# EAGLE design eNode_Spark (EAGLE 6.4)
REV: V3.3

## Sheet 1 of 4: Power & MCU
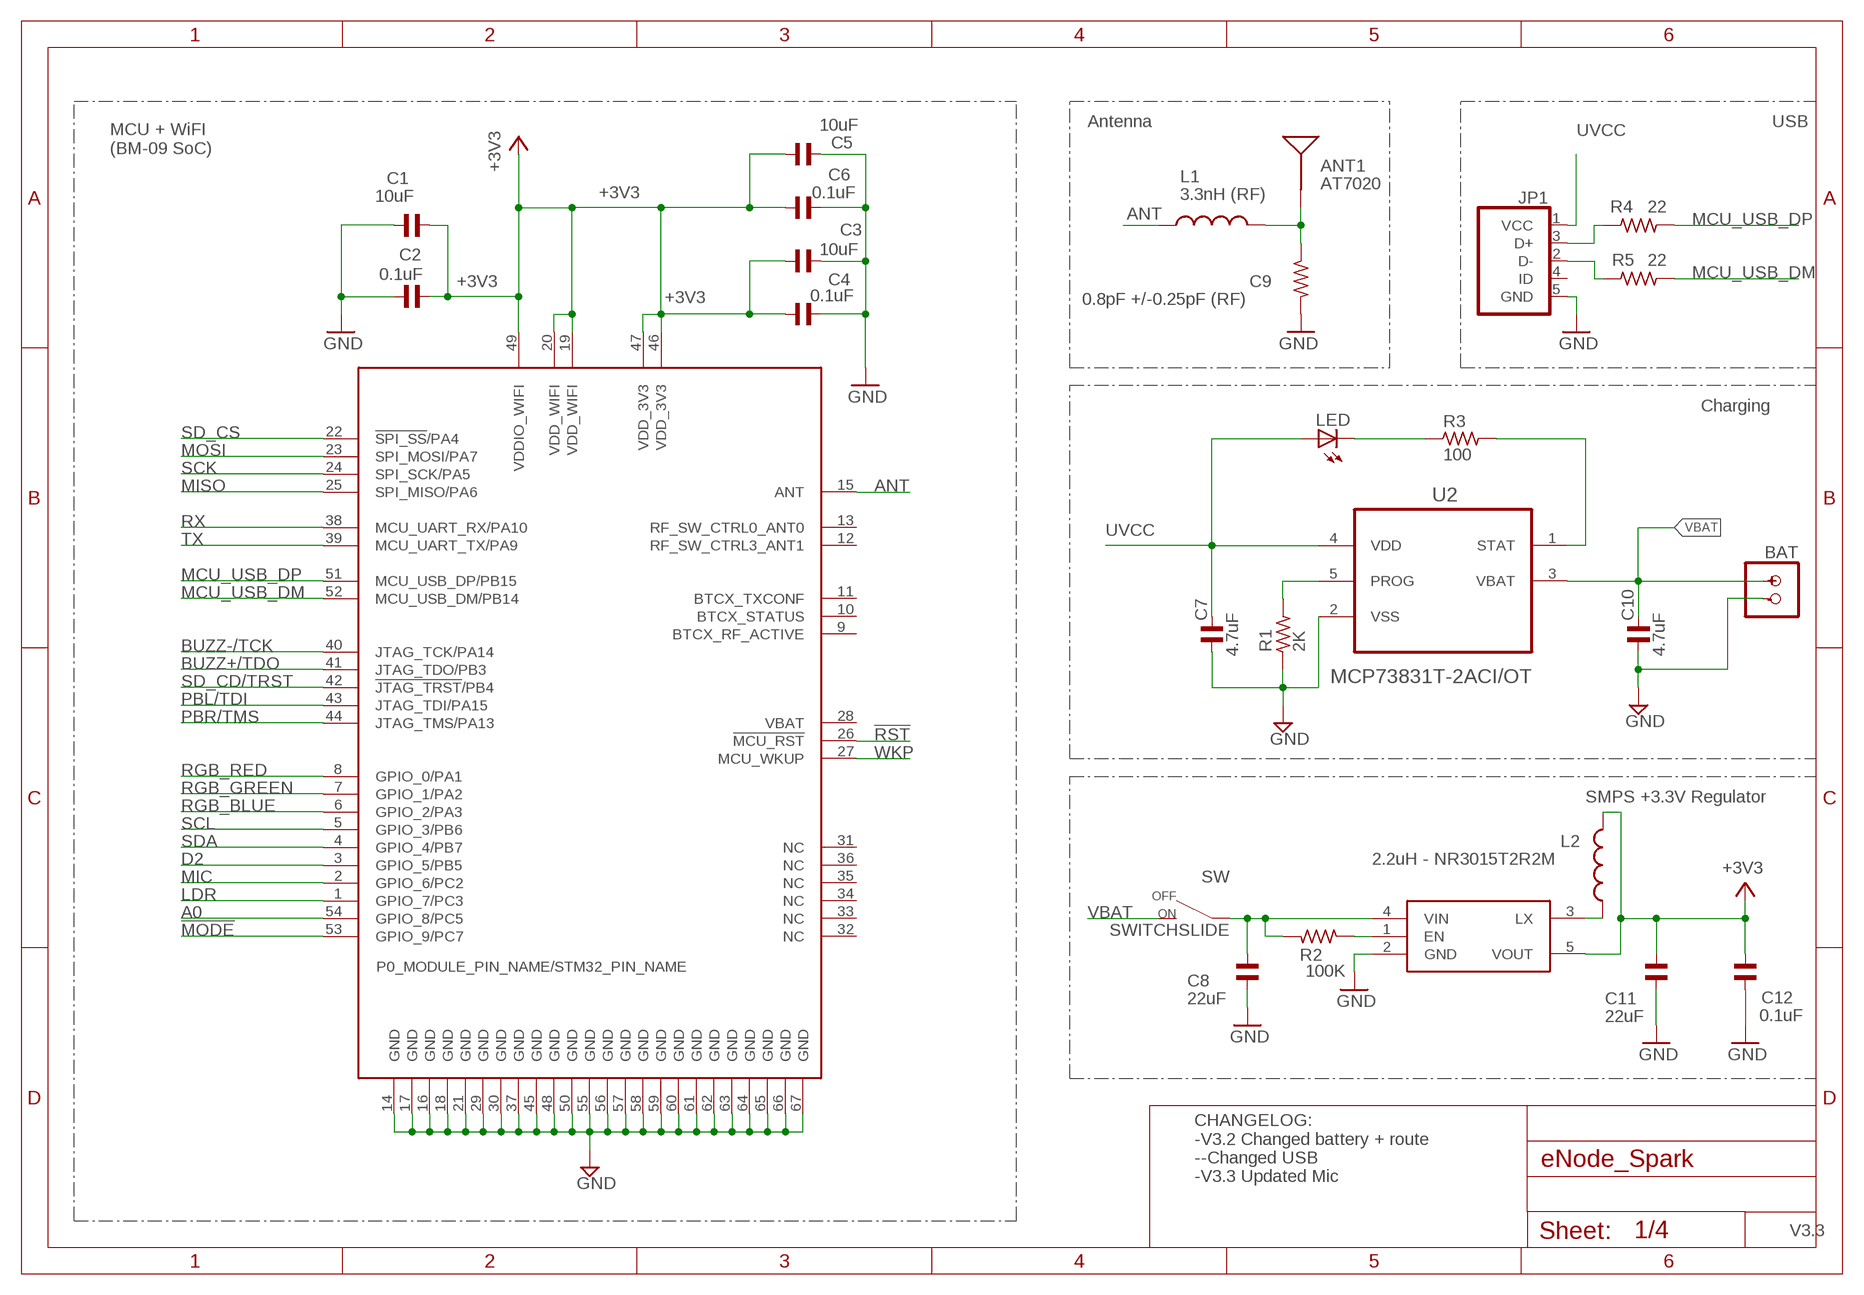
[diagram p0: schematic, sheet 1]

### Parts
ANT1  AT7020  [AT7020]
BAT  BATTERYSMT  [JST-2-SMD]
C1  10uF  C_0402  [C0402]
C2  0.1uF  C_0402  [C0402]
C3  10uF  C_0402  [C0402]
C4  0.1uF  C_0402  [C0402]
C5  10uF  C_0402  [C0402]
C6  0.1uF  C_0402  [C0402]
C7  4.7uF  C_0402  [C0402]
C8  22uF  C_0603  [C0603]
C9  0.8pF +/-0.25pF (RF)  R-US_  [R0402_B]
C10  4.7uF  C_0402  [C0402]
C11  22uF  C_0603  [C0603]
C12  0.1uF  C_0402  [C0402]
JP1  USB-RECEPTABLE  [FCI-10103594-0001LF]
L1  3.3nH (RF)  INDUCTOR  [L0402_B]
L2  2.2uH - NR3015T2R2M  INDUCTORB  [INDUCTOR-NR3015]
LED  LED  [SMARTLED-TTW]
R1  2K  R_0603  [R0603]
R2  100K  R_0402  [R0402]
R3  100  R_0603  [R0603]
R4  22  R_0402  [R0402]
R5  22  R_0402  [R0402]
SW  SWITCHSLIDE  [CHANGE_OVER_SLIDE]
U1  WM-N-BM-09  [WM-N-BM-09]
U2  MCP73831T-2ACI/OT  [SOT95P280X145-5N]
U3  R8008-33  [SOT23-5]

### Nets
!MODE: U1.53(GPIO_9/PC7) ; also sheet 3
!RST: U1.26(!MCU_RST) ; also sheet 3
+3V3: C1.2 C2.2 C3.1 C4.2 C5.1 C6.2 C11.1 C12.1 L2.2 U1.19(VDD_WIFI) U1.20(VDD_WIFI) U1.46(VDD_3V3) U1.47(VDD_3V3) U1.49(VDDIO_WIFI) U3.5(VOUT) ; also sheet 2,3,4
A0: U1.54(GPIO_8/PC5)
ANT [RF]: L1.1 U1.15(ANT)
BUZZ+/TDO: U1.41(JTAG_TDO/PB3) ; also sheet 3
BUZZ-/TCK: U1.40(JTAG_TCK/PA14) ; also sheet 3
D2: U1.3(GPIO_5/PB5) ; also sheet 4
ENABLE [vcc]: R2.1 U3.1(EN)
GND: BAT.- C1.1 C2.1 C3.2 C4.1 C5.2 C6.1 C7.1 C8.2 C9.2 C10.1 C11.2 C12.2 JP1.5(GND) R1.1 U1.14(GND) U1.16(GND) U1.17(GND) U1.18(GND) U1.21(GND) U1.29(GND) U1.30(GND) U1.37(GND) U1.45(GND) U1.48(GND) U1.50(GND) U1.55(GND) U1.56(GND) U1.57(GND) U1.58(GND) U1.59(GND) U1.60(GND) U1.61(GND) U1.62(GND) U1.63(GND) U1.64(GND) U1.65(GND) U1.66(GND) U1.67(GND) U2.2(VSS) U3.2(GND) ; also sheet 2,3,4
LDR: U1.1(GPIO_7/PC3) ; also sheet 3
MCU_USB_DM: R5.1 U1.52(MCU_USB_DM/PB14)
MCU_USB_DP: R4.1 U1.51(MCU_USB_DP/PB15)
MIC: U1.2(GPIO_6/PC2) ; also sheet 3
MISO: U1.25(SPI_MISO/PA6) ; also sheet 3,4
MOSI: U1.23(SPI_MOSI/PA7) ; also sheet 3,4
N$1 [RF]: ANT1.1(SIGNAL) C9.1 L1.2
N$2: C8.1 R2.2 SW.1 U3.4(VIN)
N$3: L2.1 U3.3(LX)
N$4: R1.2 U2.5(PROG)
N$5: LED.C@1(C) R3.1
N$6: R3.2 U2.1(STAT)
N$17: JP1.2(D-) R5.2
N$18: JP1.3(D+) R4.2
PBL/TDI: U1.43(JTAG_TDI/PA15) ; also sheet 3
PBR/TMS: U1.44(JTAG_TMS/PA13) ; also sheet 3
RGB_BLUE [vcc]: U1.6(GPIO_2/PA3) ; also sheet 3
RGB_GREEN: U1.7(GPIO_1/PA2) ; also sheet 3
RGB_RED: U1.8(GPIO_0/PA1) ; also sheet 3
RX: U1.38(MCU_UART_RX/PA10) ; also sheet 3
SCK: U1.24(SPI_SCK/PA5) ; also sheet 3,4
SCL: U1.5(GPIO_3/PB6) ; also sheet 2,4
SD_CD/TRST: U1.42(!JTAG_TRST!/PB4) ; also sheet 3
SD_CS: U1.22(!SPI_SS!/PA4) ; also sheet 3,4
SDA: U1.4(GPIO_4/PB7) ; also sheet 2,4
TX: U1.39(MCU_UART_TX/PA9) ; also sheet 3
UVCC: C7.2 JP1.1(VCC) LED.A@1(A) U2.4(VDD)
VBAT: BAT.+ C10.2 SW.2 U2.3(VBAT)
WKP: U1.27(MCU_WKUP) ; also sheet 2,4
Unconnected: JP1.4(ID) U1.9(BTCX_RF_ACTIVE) U1.10(BTCX_STATUS) U1.11(BTCX_TXCONF) U1.12(RF_SW_CTRL3_ANT1) U1.13(RF_SW_CTRL0_ANT0) U1.28(VBAT) U1.31(NC) U1.32(NC) U1.33(NC) U1.34(NC) U1.35(NC) U1.36(NC)

### Notes on the sheet
- Antenna | USB
- MCU + WiFI
  (BM-09 SoC)
- Charging
- SMPS +3.3V Regulator
- CHANGELOG:
  -V3.2 Changed battery + route
  --Changed USB
  -V3.3 Updated Mic

## Sheet 2 of 4: I2C
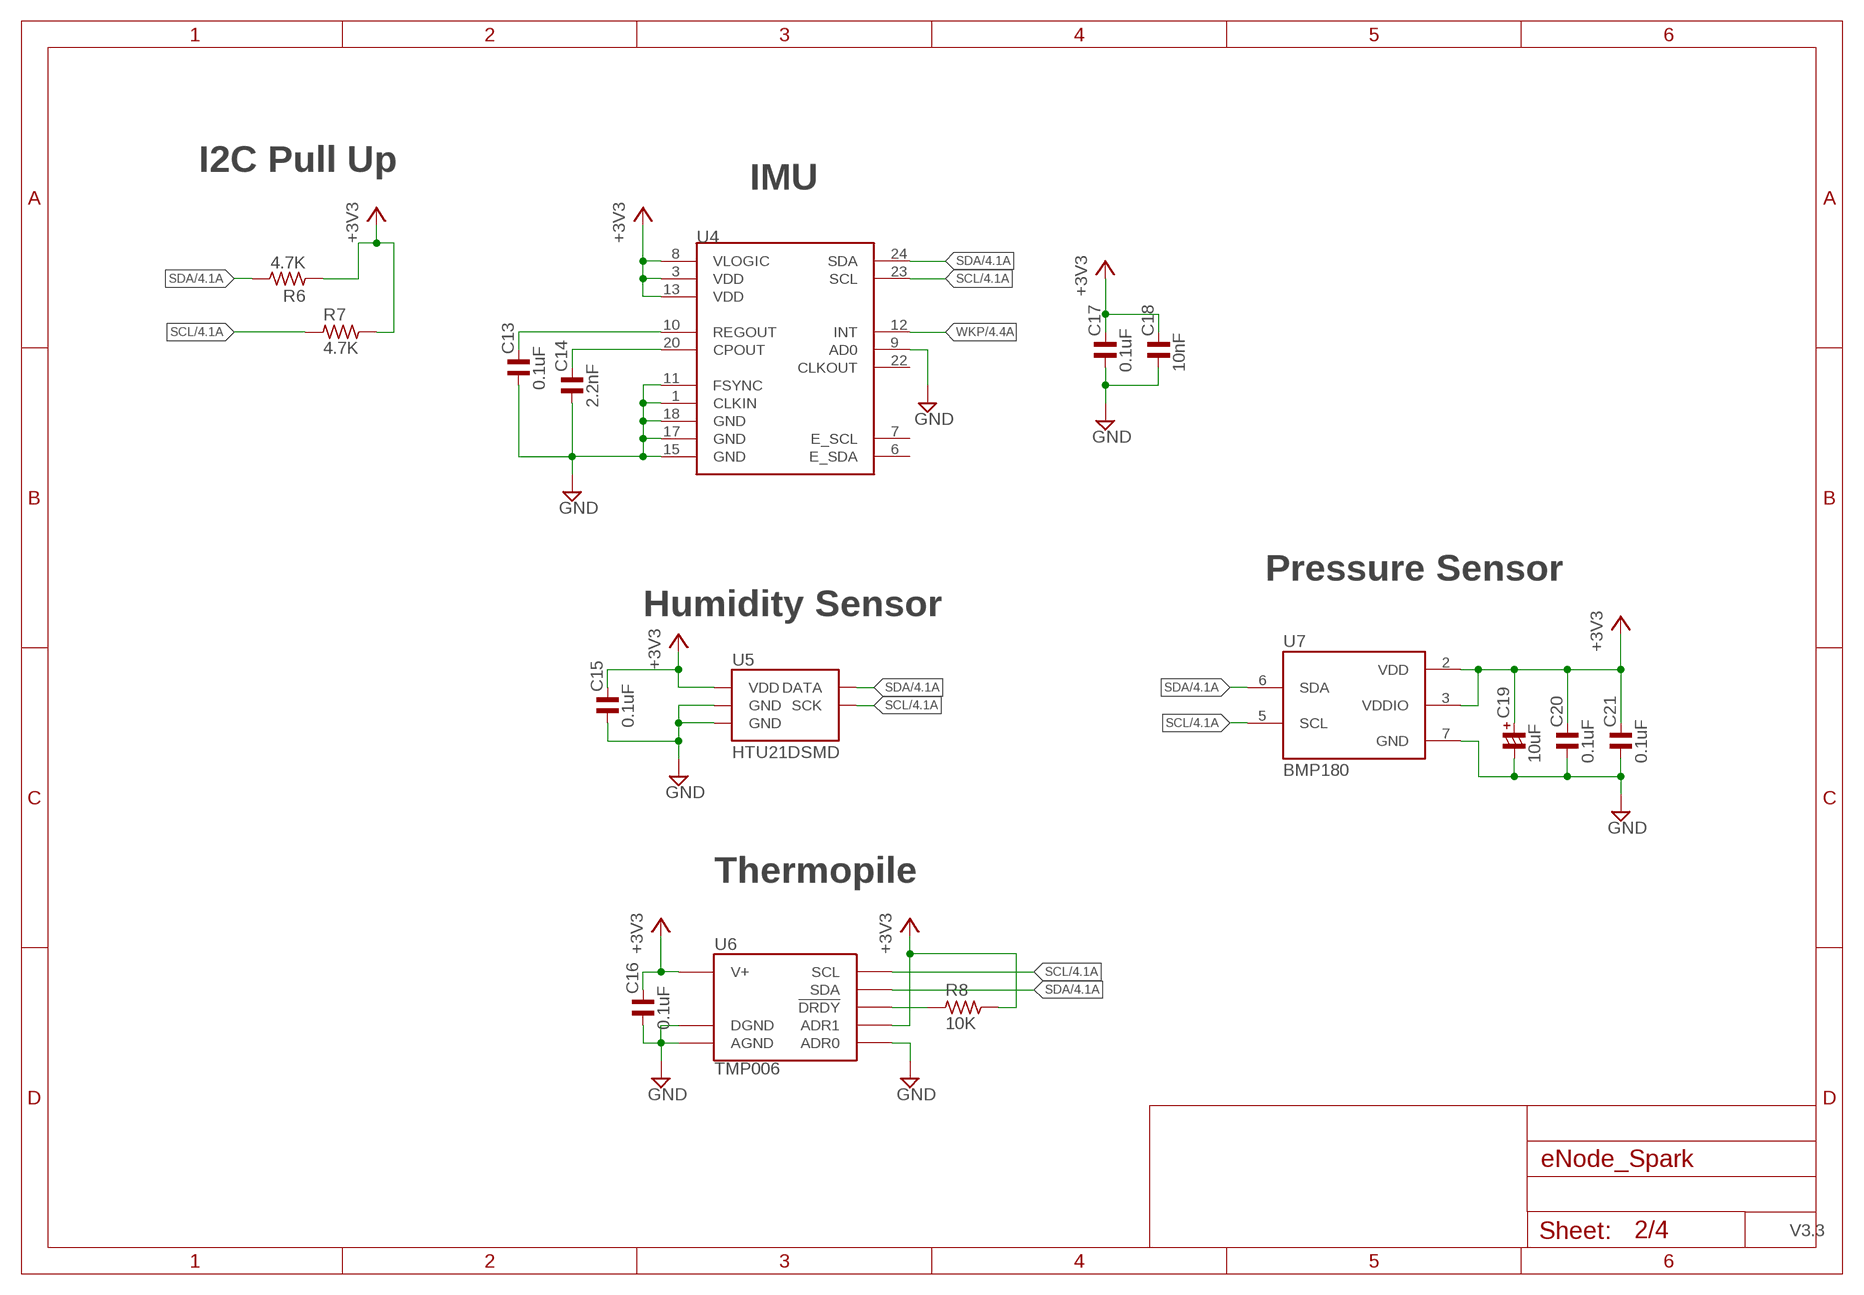
[diagram p1: schematic, sheet 2]

### Parts
C13  0.1uF  C_0402  [C0402]
C14  2.2nF  C_0402  [C0402]
C15  0.1uF  C_0402  [C0402]
C16  0.1uF  C_0402  [C0402]
C17  0.1uF  C_0402  [C0402]
C18  10nF  C_0402  [C0402]
C19  10uF  CP_1206/T  [C1206/T]
C20  0.1uF  C_0402  [C0402]
C21  0.1uF  C_0402  [C0402]
R6  4.7K  R_0402  [R0402]
R7  4.7K  R_0402  [R0402]
R8  10K  R_0603  [R0603]
U4  MPU-9150QFN-24-NP  [QFN-24-NP]
U5  HTU21DSMD  [HTU21D]
U6  TMP006  [BGA8DS]
U7  BMP180  [BMP180]

### Nets
+3V3: C15.2 C16.2 C17.2 C18.2 C19.+ C20.2 C21.2 R6.1 R7.2 R8.2 U4.3(VDD) U4.8(VLOGIC) U4.13(VDD) U5.VDD U6.A3(V+) U6.B1(ADR1) U7.2(VDD) U7.3(VDDIO) ; also sheet 1,3,4
GND: C13.1 C14.1 C15.1 C16.1 C17.1 C18.1 C19.- C20.1 C21.1 U4.1(CLKIN) U4.9(AD0) U4.11(FSYNC) U4.15(GND) U4.17(GND) U4.18(GND) U5.7(GND) U5.GND U6.A1(DGND) U6.A2(AGND) U6.C1(ADR0) U7.7(GND) ; also sheet 1,3,4
N$12: C14.2 U4.20(CPOUT)
N$13: R8.1 U6.C2(!DRDY)
N$14: C13.2 U4.10(REGOUT)
SCL: R7.1 U4.23(SCL) U5.SCK U6.B3(SCL) U7.5(SCL) ; also sheet 1,4
SDA: R6.2 U4.24(SDA) U5.DATA U6.C3(SDA) U7.6(SDA) ; also sheet 1,4
WKP: U4.12(INT) ; also sheet 1,4
Unconnected: U4.6(E_SDA) U4.7(E_SCL) U4.22(CLKOUT)

### Notes on the sheet
- I2C Pull Up
- IMU
- Pressure Sensor
- Humidity Sensor
- Thermopile

## Sheet 3 of 4: Other IO
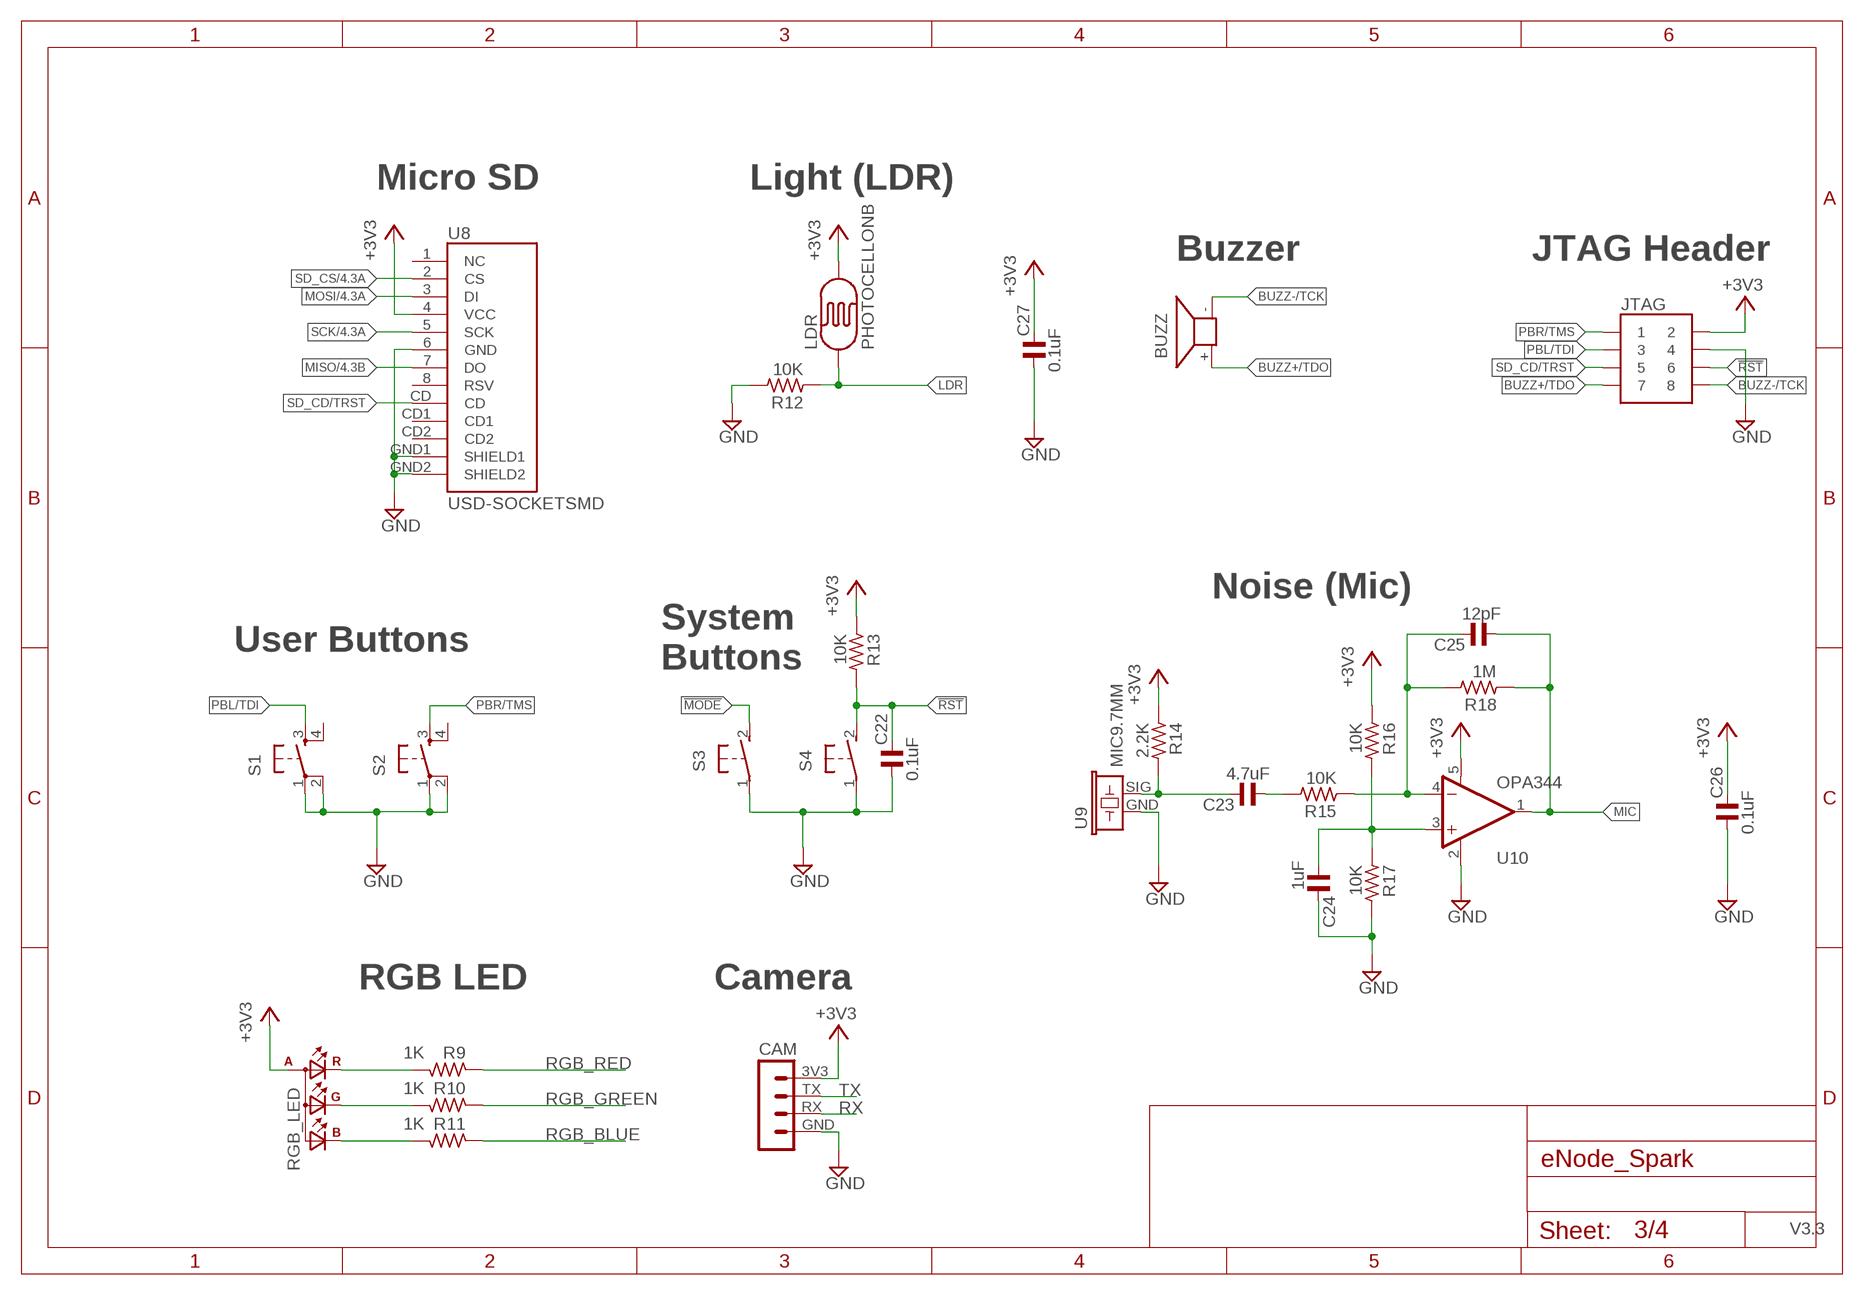
[diagram p2: schematic, sheet 3]

### Parts
BUZZ  BUZZER  [OFFBOARD_NOSIGN]
C22  0.1uF  C_0402  [C0402]
C23  4.7uF  C_0402  [C0402]
C24  1uF  C_0402  [C0402]
C25  12pF  C_0402  [C0402]
C26  0.1uF  C_0402  [C0402]
C27  0.1uF  C_0402  [C0402]
CAM  MA04-1  [MA04-1]
JTAG  JTAG_CONNECTOR  [JTAG_DIP]
LDR  PHOTOCELLONB  [ON_BOARD]
R9  1K  R_0402  [R0402]
R10  1K  R_0402  [R0402]
R11  1K  R_0402  [R0402]
R12  10K  R_0603  [R0603]
R13  10K  R_0402  [R0402]
R14  2.2K  R_0402  [R0402]
R15  10K  R_0402  [R0402]
R16  10K  R_0402  [R0402]
R17  10K  R_0402  [R0402]
R18  1M  R_0402  [R0402]
RGB_LED  TOPLED-3PLCC  [P-LCC-4-3]
S1  TAC_SWITCH_4SMD  [TACTILE_SWITCH_SMD_LARGE_4]
S2  TAC_SWITCH_4SMD  [TACTILE_SWITCH_SMD_LARGE_4]
S3  MODE  TAC_SWITCH_2MULTICOMP  [DTSM-3]
S4  RESET  TAC_SWITCH_2MULTICOMP  [DTSM-3]
U8  USD-SOCKETSMD  [MICRO-SD-SOCKET-PP]
U9  MIC9.7MM  [MIC-9.7MM]
U10  OPA344  [SOT23-5]

### Nets
!MODE: S3.2 ; also sheet 1
!RST: C22.2 JTAG.6 R13.2 S4.2 ; also sheet 1
+3V3: C26.2 C27.2 CAM.3V3 JTAG.2 LDR.2 R13.1 R14.1 R16.1 RGB_LED.A(A2) U8.4(VCC) U10.5(V+) ; also sheet 1,2,4
BUZZ+/TDO: BUZZ.+ JTAG.7 ; also sheet 1
BUZZ-/TCK: BUZZ.- JTAG.8 ; also sheet 1
GND: C22.1 C24.2 C26.1 C27.1 CAM.GND JTAG.4 R12.2 R17.2 S1.1 S1.2 S2.1 S2.2 S3.1 S4.1 U8.6(GND) U8.GND1(SHIELD1) U8.GND2(SHIELD2) U9.GND U10.2(V-) ; also sheet 1,2,4
LDR: LDR.1 R12.1 ; also sheet 1
MIC: C25.1 R18.1 U10.1(OUT) ; also sheet 1
MISO: U8.7(DO) ; also sheet 1,4
MOSI: U8.3(DI) ; also sheet 1,4
N$7: C23.1 R15.2
N$8: C25.2 R15.1 R18.2 U10.4(-IN)
N$9: C24.1 R16.2 R17.1 U10.3(+IN)
N$10: C23.2 R14.2 U9.SIG
N$27: R10.1 RGB_LED.G(CGREEN)
N$29: R11.1 RGB_LED.B(CBLUE)
N$54: R9.1 RGB_LED.R(CRED)
PBL/TDI: JTAG.3 S1.3 ; also sheet 1
PBR/TMS: JTAG.1 S2.3 ; also sheet 1
RGB_BLUE [vcc]: R11.2 ; also sheet 1
RGB_GREEN: R10.2 ; also sheet 1
RGB_RED: R9.2 ; also sheet 1
RX: CAM.RX ; also sheet 1
SCK: U8.5(SCK) ; also sheet 1,4
SD_CD/TRST: JTAG.5 U8.CD ; also sheet 1
SD_CS: U8.2(CS) ; also sheet 1,4
TX: CAM.TX ; also sheet 1
Unconnected: S1.4 S2.4 U8.1(NC) U8.8(RSV) U8.CD1 U8.CD2

### Notes on the sheet
- Micro SD | Light (LDR)
- Buzzer | JTAG Header
- Noise (Mic)
- User Buttons
- System
  Buttons
- RGB LED | Camera

## Sheet 4 of 4: V3.4
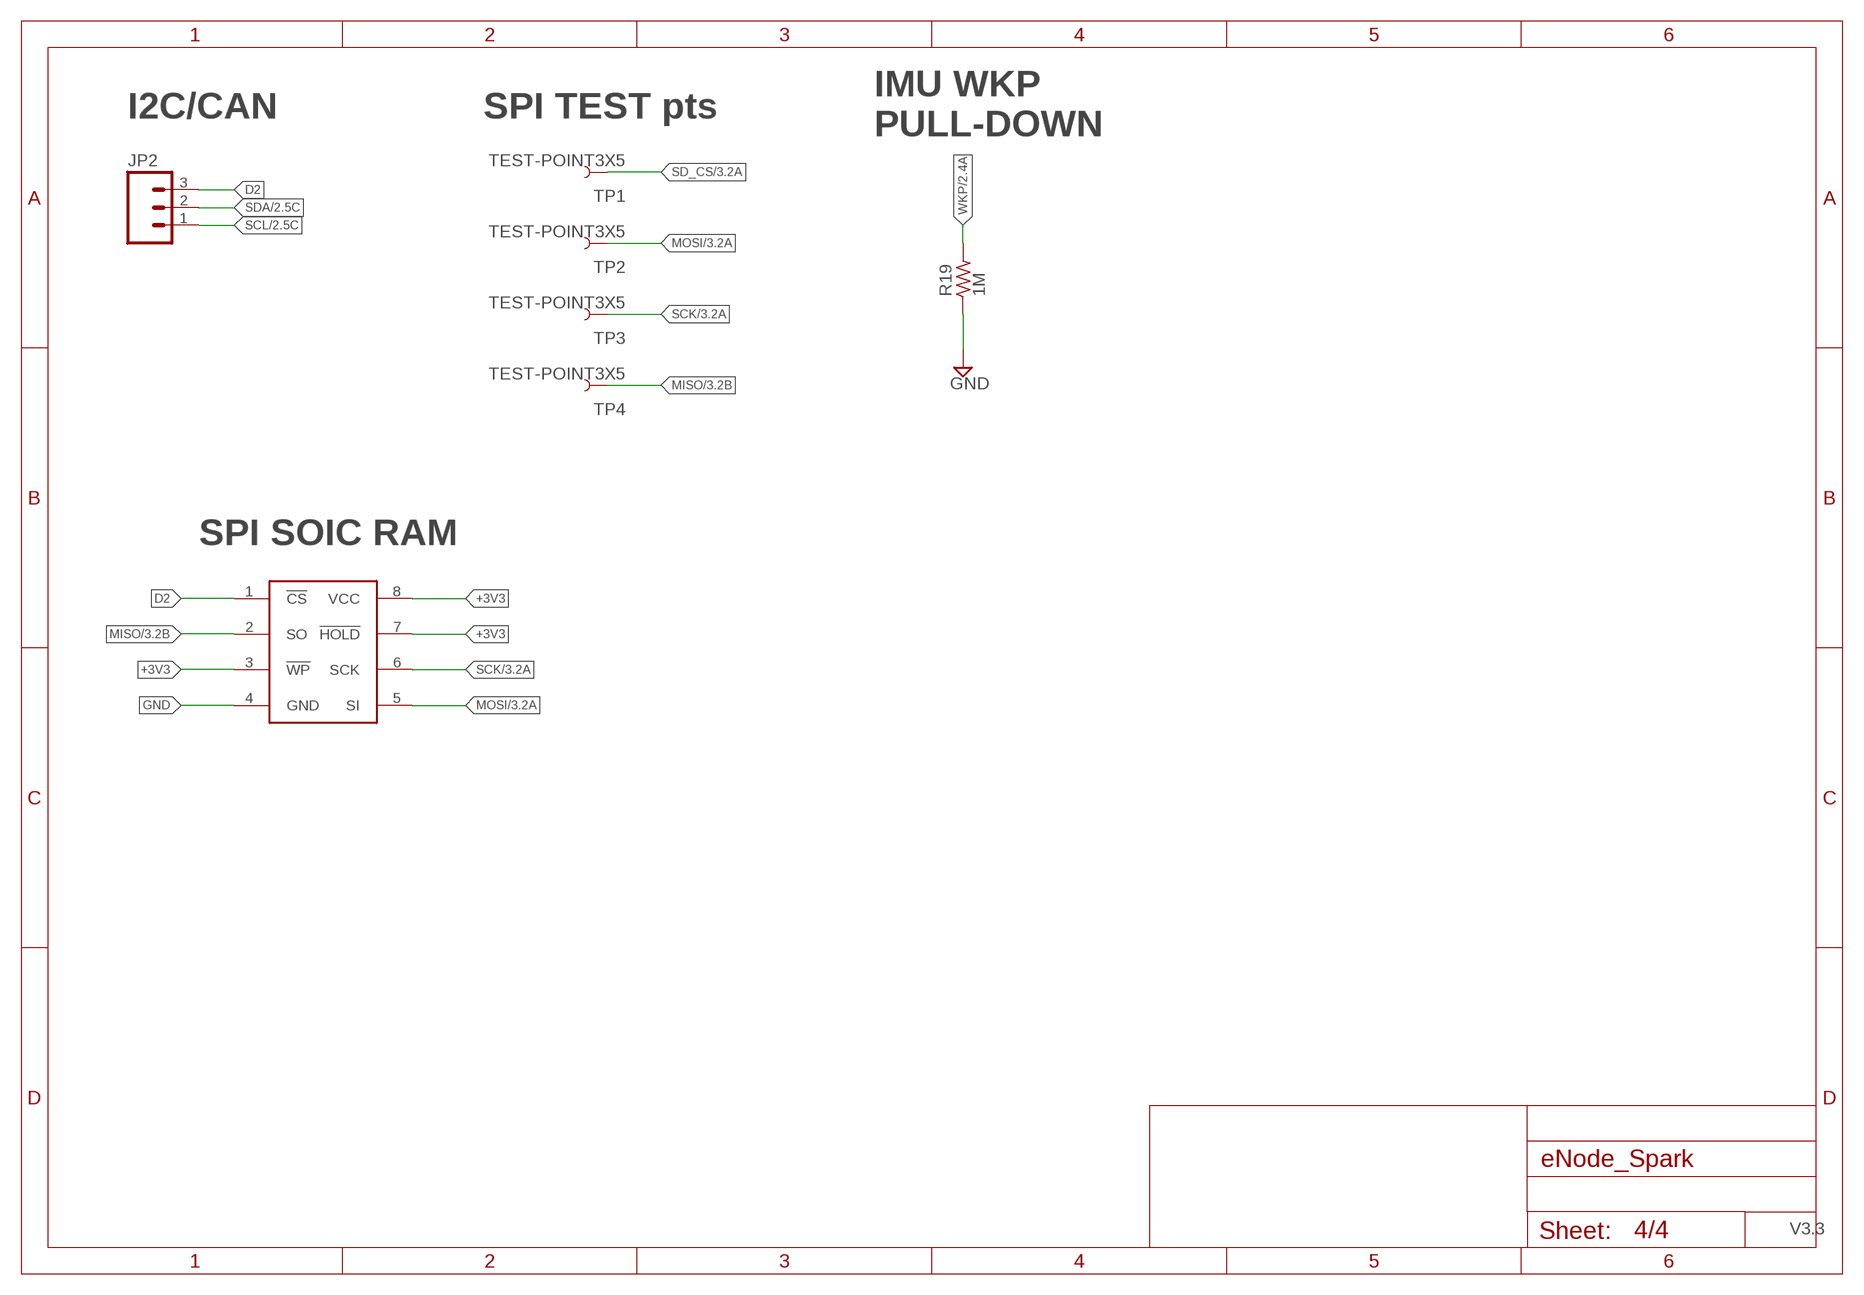
[diagram p3: schematic, sheet 4]

### Parts
JP2  M03PTH  [1X03]
R19  1M  R_0402  [R0402]
TP1  TEST-POINT3X5  [PAD.03X.05]
TP2  TEST-POINT3X5  [PAD.03X.05]
TP3  TEST-POINT3X5  [PAD.03X.05]
TP4  TEST-POINT3X5  [PAD.03X.05]
U11  FRAM  [SO08]

### Nets
+3V3: U11.3(!WP) U11.7(!HOLD) U11.8(VCC) ; also sheet 1,2,3
D2: JP2.3 U11.1(!CS) ; also sheet 1
GND: R19.1 U11.4(GND) ; also sheet 1,2,3
MISO: TP4.P$1 U11.2(SO) ; also sheet 1,3
MOSI: TP2.P$1 U11.5(SI) ; also sheet 1,3
SCK: TP3.P$1 U11.6(SCK) ; also sheet 1,3
SCL: JP2.1 ; also sheet 1,2
SD_CS: TP1.P$1 ; also sheet 1,3
SDA: JP2.2 ; also sheet 1,2
WKP: R19.2 ; also sheet 1,2

### Notes on the sheet
- I2C/CAN | SPI TEST pts
- IMU WKP 
  PULL-DOWN
- SPI SOIC RAM

## Library data of the parts
ANT1 = Spark:AT7020
BAT = Battery:BATTERY: PIN HEADER
BUZZ = Buzzer:BUZZER: Buzzer
C1-C8 C10-C18 C20-C27 = rc-master-smd:C_: NON-POLARIZED CAP
C9 = Spark:R-US_: 0402 Resistor
C19 = rc-master-smd:CP_: POLARIZED CAP
CAM = Camera Header:MA04-1: PIN HEADER; OC_FARNELL: unknown; OC_NEWARK: unknown
JP1 = Micro USB:USB-RECEPTABLE: USB Receptable
JP2 = SparkFun-Connectors:M03: Header 3 Standard 3-pin 0.1" header. Use with straight break away headers (SKU : PRT-00116), right angle break away headers (PRT-00553), swiss pins (PRT-00743), machine pins (PRT-00117), and female headers (PRT-00115). Molex polarized connector foot print use with SKU : PRT-08232 with associated crimp pins and housings.
JTAG = JTAG Connector:JTAG_CONNECTOR
L1 L2 = Spark:INDUCTOR
LDR = LDR:PHOTOCELL: Photo Resitor
LED = LED:LED: LED OSRAM: - CHIPLED LG R971, LG N971, LY N971, LG Q971, LY Q971, LO R971, LY R971 LH N974, LH R974 LS Q976, LO Q976, LY Q976 LO Q996 - Hyper CHIPLED LW Q18S LB Q993, LB Q99A, LB R99A - SideLED LS A670, LO A670, LY A670, LG A670, LP A670 LB A673, LV A673, LT A673, LW A673 LH A674 LY A675 LS A676, LA A676, LO A676, LY A676, LW A676 LS A679, LY A679, LG A679 - Hyper Micro SIDELED® LS Y876, LA Y876, LO Y876, LY Y876 LT Y87S - SmartLED LW L88C, LW L88S LB L89C, LB L89S, LG L890 LS L89K, LO L89K, LY L89K LS L896, LA L896, LO L896, LY L896 - TOPLED LS T670, LO T670, LY T670, LG T670, LP T670 LSG T670, LSP T670, LSY T670, LOP T670, LYG T670 LG T671, LOG T671, LSG T671 LB T673, LV T673, LT T673, LW T673 LH T674 LS T676, LA T676, LO T676, LY T676, LB T676, LH T676, LSB T676, LW T676 LB T67C, LV T67C, LT T67C, LS T67K, LO T67K, LY T67K, LW E67C LS E67B, LA E67B, LO E67B, LY E67B, LB E67C, LV E67C, LT E67C LW T67C LS T679, LY T679, LG T679 LS T770, LO T770, LY T770, LG T770, LP T770 LB T773, LV T773, LT T773, LW T773 LH T774 LS E675, LA E675, LY E675, LS T675 LS T776, LA T776, LO T776, LY T776, LB T776 LHGB T686 LT T68C, LB T68C - Hyper Mini TOPLED® LB M676 - Mini TOPLED Santana® LG M470 LS M47K, LO M47K, LY M47K Source: http://www.osram.convergy.de LUXEON: - LUMILED® LXK2-PW12-R00, LXK2-PW12-S00, LXK2-PW14-U00, LXK2-PW14-V00 LXK2-PM12-R00, LXK2-PM12-S00, LXK2-PM14-U00 LXK2-PE12-Q00, LXK2-PE12-R00, LXK2-PE12-S00, LXK2-PE14-T00, LXK2-PE14-U00 LXK2-PB12-K00, LXK2-PB12-L00, LXK2-PB12-M00, LXK2-PB14-N00, LXK2-PB14-P00, LXK2-PB14-Q00 LXK2-PR12-L00, LXK2-PR12-M00, LXK2-PR14-Q00, LXK2-PR14-R00 LXK2-PD12-Q00, LXK2-PD12-R00, LXK2-PD12-S00 LXK2-PH12-R00, LXK2-PH12-S00 LXK2-PL12-P00, LXK2-PL12-Q00, LXK2-PL12-R00 Source: www.luxeon.com KINGBRIGHT: KA-3528ASYC Source: www.kingbright.com
R1-R19 = rc-master-smd:R_: RESISTOR
RGB_LED = SMD RGB LED:TOPLED-3: Cree P/N: CLV1L-FKB-CHMMQEHBB7673673
S1 S2 = TACT BUTTON:TAC_SWITCH_4
S3 S4 = TACT BUTTON:TAC_SWITCH_2
SW = Switch:SWITCH
TP1-TP4 = SparkFun-Passives:TEST-POINT: Bare copper test points for troubleshooting or ICT
U1 = Spark:WM-N-BM-09
U2 = MCP73831T (LiPo Charger):MCP73831T-2ACI/OT: Charge Management Controller; MPN: MCP73831T-2ACI/OT; OC_FARNELL: 1332158; OC_NEWARK: 56K7045; PACKAGE: SOT-5; SUPPLIER: Microchip
U3 = Spark:R8008-33
U4 = MPU-9150:MPU-9150: 9DOF (3mag, 3accel, 3rotat). I2C interface.
U5 = HTU21D:HTU21D
U6 = TMP006:TMP006
U7 = BMP180:BMP180: BOSCH BMP180 DIGITAL BAROMETRIC PRESSURE SENSOR Web page: http://www.bosch-sensortec.com/en/homepage/products_3/environmental_sensors_1/bmp180_1/bmp180 Datasheet: http://ae-bst.resource.bosch.com/media/products/dokumente/bmp180/BST-BMP180-DS000-09.pdf The BMP180 is the function compatible successor of the BMP085, a new generation of high precision digital pressure sensors for consumer applications. The ultra-low power, low voltage electronics of the BMP180 is optimized for use in mobile phones, PDAs, GPS navigation devices and outdoor equipment. With a low altitude noise of merely 0.25m at fast conversion time, the BMP180 offers superior performance. The I2C interface allows for easy system integration with a microcontroller. The BMP180 is based on piezo-resistive technology for EMC robustness, high accuracy and linearity as well as long term stability. Key features: - Temperature measurement included - I2C interface - Fully calibrated - Pb-free, halogen-free and RoHS compliant, - MSL 1 Basic specs: Pressure range: 300 to 1100hPa (+9000m to -500m relating to sea level) Supply voltage: 1.8 to 3.6V (VDD), 1.62V to 3.6V (VDDIO) Package: LGA package with metal lid Small footprint: 3.6mm x 3.8mm Super-flat: 0.93mm height Low power: 5µA at 1 sample / sec. in standard mode Low noise: 0.06hPa (0.5m) in ultra low power mode, 0.02hPa (0.17m) advanced resolution mode Typical applications: - Enhancement of GPS navigation (dead-reckoning, slope detection, etc.) - In- and out-door navigation - Leisure and sports - Weather forecast - Vertical velocity indication (rise/sink speed)
U8 = MicroSD:USD-SOCKET: microSD Socket Push-push type uSD socket. Schematic element and footprint production proven. Spark Fun Electronics SKU : PRT-00127. tDoc lines correctly indicate media card edge positions when inserting (unlocked, locked, depressed).; ORDERCODE: 2143377; SUPPLIER: ELEMENT14
U9 = MIC:MIC: Microphone Omni-directional electret microphone. 9.7mm standard diameter.
U10 = OPA344:OPA344
U11 = kennethlimcp:FRAM: 8-SOIC FRAM

## Net classes
2 RF: width 0.33 mm, clearance 0.178 mm

## Board
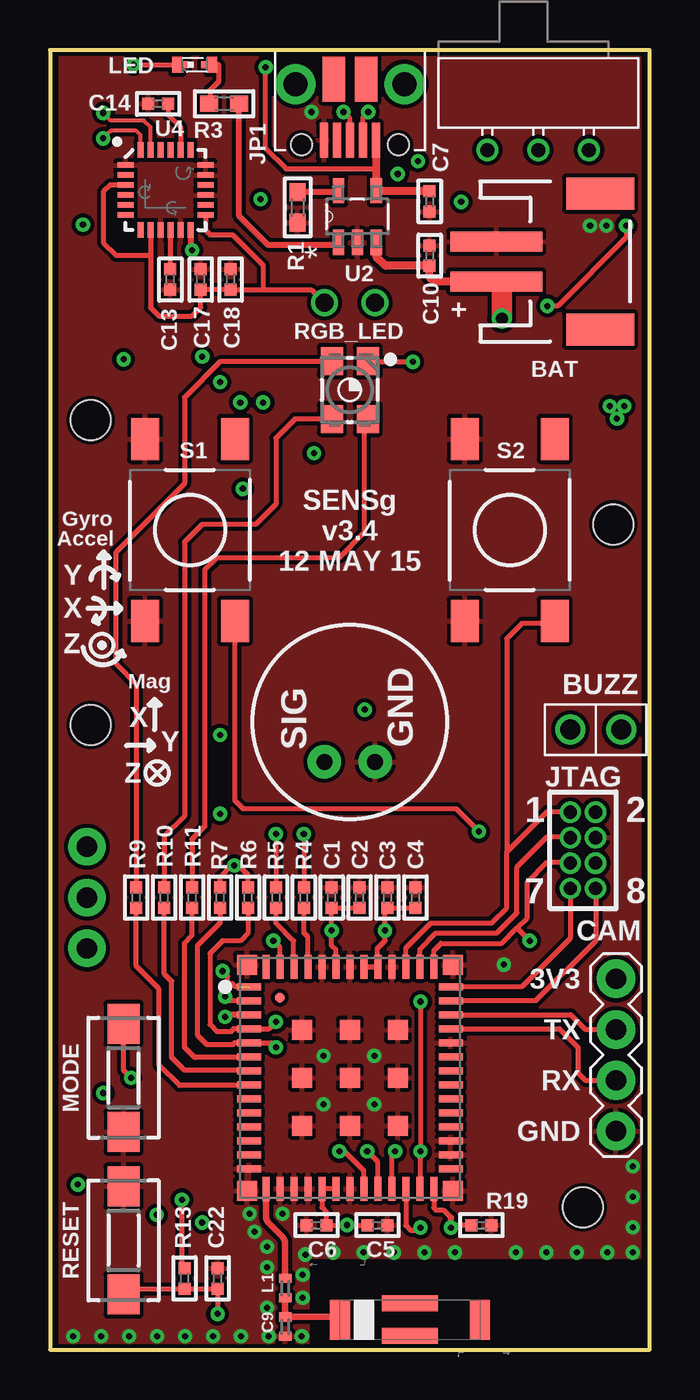
[diagram p4: board, top side]
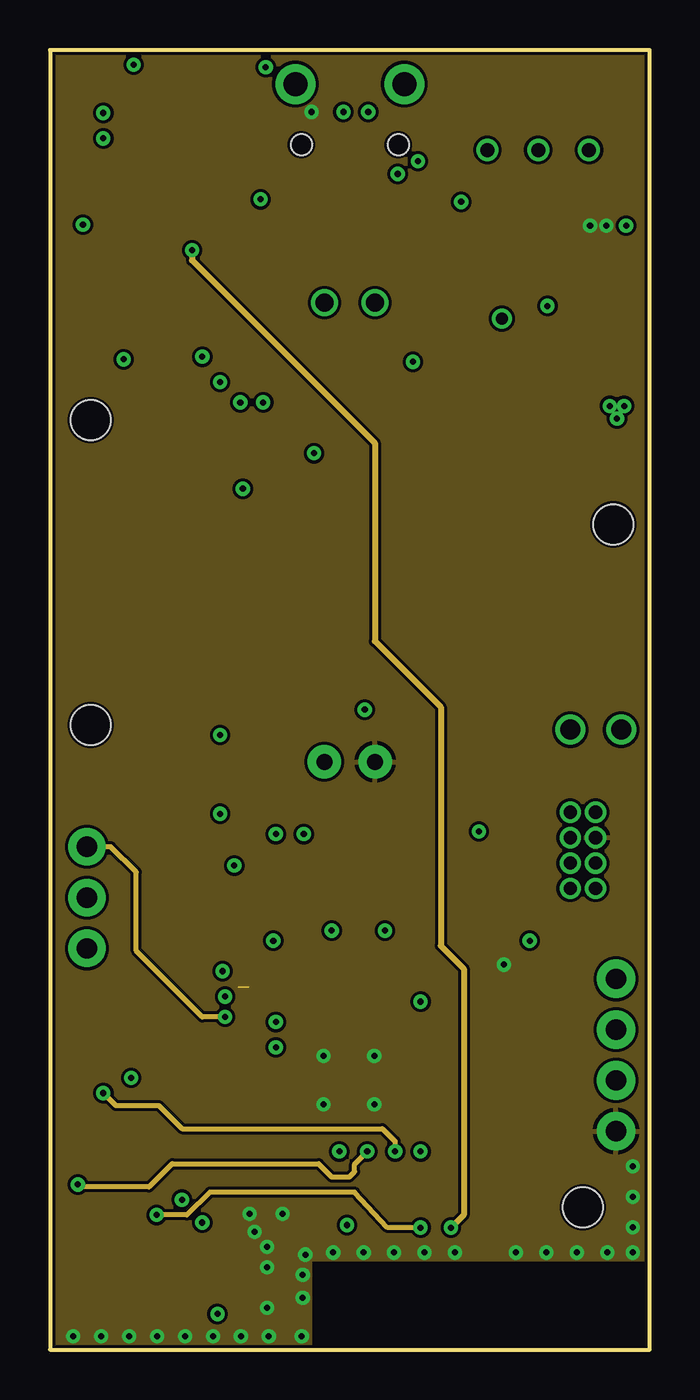
[diagram p5: board, inner layer $GND]
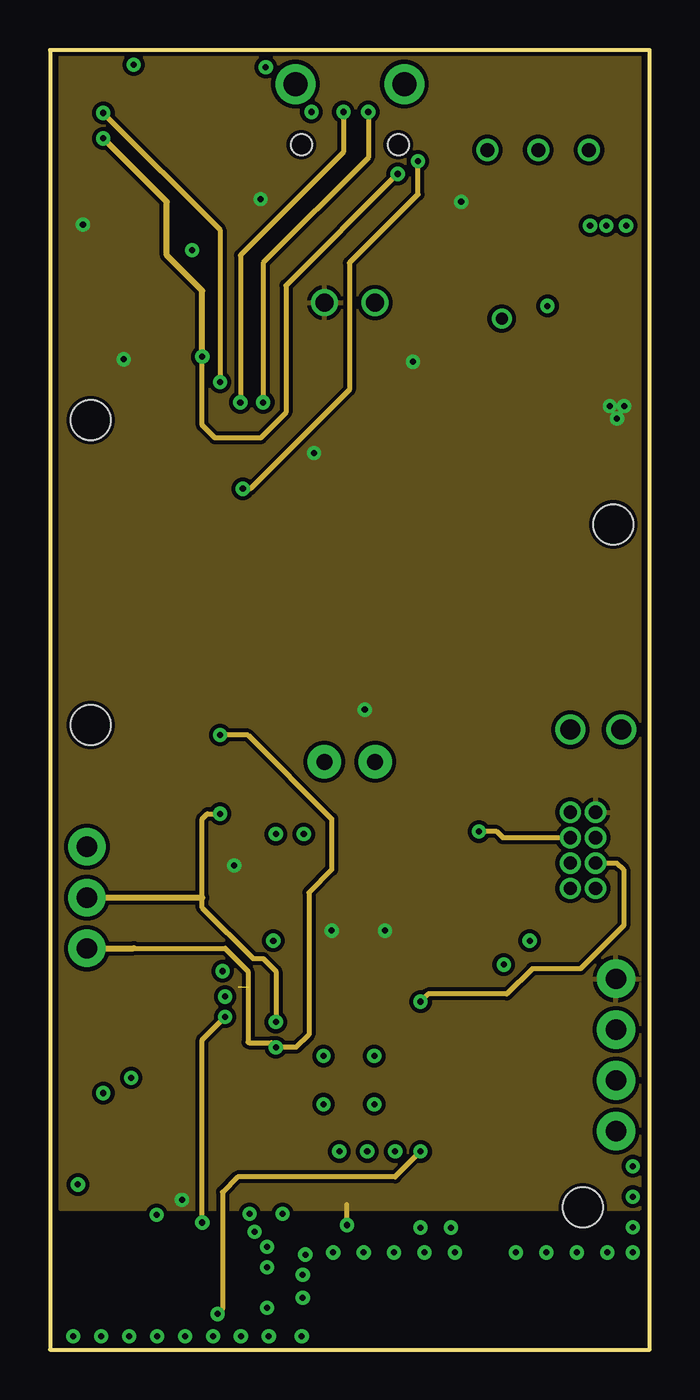
[diagram p6: board, inner layer $+3V3]
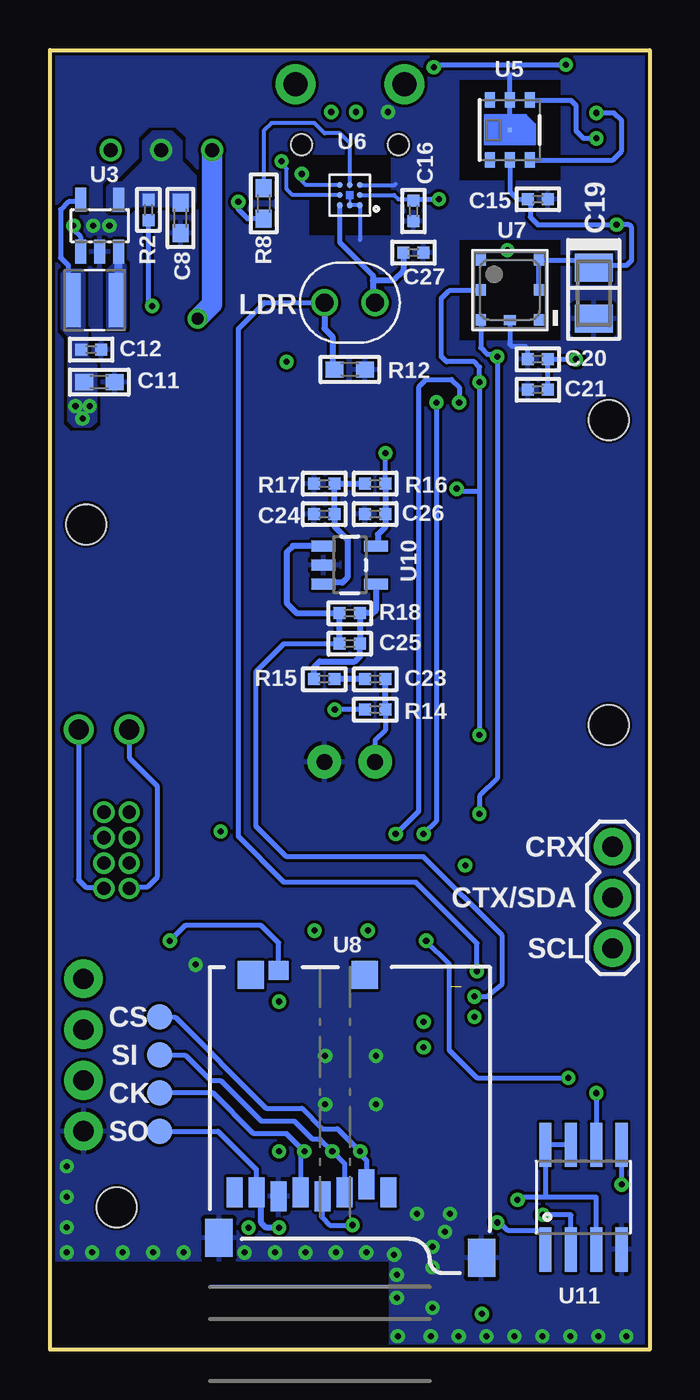
[diagram p7: board, bottom side, seen from below]

Size 30 x 65 mm. Coordinates in mm from the lower left corner, seen from the top.
Outline: 0,0 30,0 30,65 0,65 0,0
Copper layers (1+2*15+16): Top 0.018mm / dielectric 0.195mm / $GND 0.035mm / dielectric 1.1mm / $+3V3 0.035mm / dielectric 0.195mm / Bottom 0.018mm
Design rules "spark-4layer-custom": minimum track width 6mil, minimum drill 0.3mm, track to track 6mil, track to pad 6mil, pad to pad 6mil, via to via 6mil, smd to smd 6mil, copper to edge 6mil, drill to drill 6mil, minimum pad ring 8mil, minimum via ring 8mil, stop-mask expansion 4mil, vias tented up to drill 20mil, thermal gap 8mil
Holes 2 mm at 26.67,7.11 28.19,41.27 2.03,46.48 2.03,31.24

### Footprints (pad centres in the part's own frame; a part is rotated, then mirrored left to right if it is on the bottom)
AT7020 = smd 1 x 2: 1 3.5,0; 3 -3.5,0 | smd 2.8 x 0.8: 2 0,0.815; 4 0,-0.815
JST-2-SMD = smd 1 x 4.6: + 1,-3.7; - -1,-3.7 | smd 1.6 x 3.4: NC1 -3.4,1.5; NC2 3.4,1.5
OFFBOARD_NOSIGN = drill 1: + -1.27,0; - 1.27,0
C0402 = smd 0.6 x 0.6: 1 -0.508,0; 2 0.508,0
C0603 = smd 0.9 x 0.8: 1 -0.762,0; 2 0.762,0
R0402_B = smd 0.457 x 0.61: 1 -0.483,0; 2 0.483,0
C1206/T = smd 1.4 x 1.9: + 1.27,0; - -1.27,0
MA04-1 = drill 1.016 pad 1.93: 3V3 3.81,0; GND -3.81,0; RX -1.27,0; TX 1.27,0
FCI-10103594-0001LF = smd 0.4 x 1.75: 1 -1.3,4.525; 2 -0.65,4.525; 3 0,4.525; 4 0.65,4.525; 5 1.3,4.525 | smd 1.125 x 2.25: 11 -0.812,1.45; 12 0.812,1.45 | drill 1.2 pad 2: P$3 -2.725,1.7; P$4 2.725,1.7 | hole 1.05: -2.425,4.73; 2.425,4.73
1X03 = drill 1.016 pad 1.88: 1 0,0; 2 2.54,0; 3 5.08,0
JTAG_DIP = drill 0.66 pad 1.016: 1 0,0; 2 1.27,0; 3 0,-1.27; 4 1.27,-1.27; 5 0,-2.54; 6 1.27,-2.54; 7 0,-3.81; 8 1.27,-3.81
L0402_B = smd 0.457 x 0.61: 1 -0.483,0; 2 0.483,0
INDUCTOR-NR3015 = smd 0.8 x 2.7: 1 -1.1,0; 2 1.1,0
ON_BOARD = drill 0.9: 1 -1.27,0; 2 1.27,0
SMARTLED-TTW = smd 0.8 x 0.5: A 0,-0.875; C 0,0.875 | smd 0.35 x 0.35: A@1 0,-0.5; C@1 0,0.5
R0603 = smd 0.9 x 0.8: 1 -0.762,0; 2 0.762,0
R0402 = smd 0.6 x 0.6: 1 -0.508,0; 2 0.508,0
P-LCC-4-3 = smd 1.1 x 1.4: A 0.9,1.45; B 0.9,-1.45; G -0.9,-1.45; R -0.9,1.45
TACTILE_SWITCH_SMD_LARGE_4 = smd 1.4 x 2.1: 1 2.25,4.55; 2 2.25,-4.55; 3 -2.25,4.55; 4 -2.25,-4.55
DTSM-3 = smd 2 x 1.6: 1 -2.7,0; 2 2.7,0
CHANGE_OVER_SLIDE = drill 0.7: 1 0,0; 2 -2.54,0; 3 2.54,0
PAD.03X.05 = smd 1.27 x 1.27: P$1 0,0
WM-N-BM-09 = smd 0.35 x 1.2: 1 4.55,5.05; 2 3.85,5.05; 3 3.15,5.05; 4 2.45,5.05; 5 1.75,5.05; 6 1.05,5.05; 7 0.35,5.05; 8 -0.35,5.05; 9 -1.05,5.05; 10 -1.75,5.05; 11 -2.45,5.05; 12 -3.15,5.05; 13 -3.85,5.05; 14 -4.55,5.05; 28 -4.55,-5.05; 29 -3.85,-5.05; 30 -3.15,-5.05; 31 -2.45,-5.05; 32 -1.75,-5.05; 33 -1.05,-5.05; 34 -0.35,-5.05; 35 0.35,-5.05; 36 1.05,-5.05; 37 1.75,-5.05; 38 2.45,-5.05; 39 3.15,-5.05; 40 3.85,-5.05; 41 4.55,-5.05 | smd 1.2 x 0.35: 15 -5.55,4.2; 16 -5.55,3.5; 17 -5.55,2.8; 18 -5.55,2.1; 19 -5.55,1.4; 20 -5.55,0.7; 21 -5.55,0; 22 -5.55,-0.7; 23 -5.55,-1.4; 24 -5.55,-2.1; 25 -5.55,-2.8; 26 -5.55,-3.5; 27 -5.55,-4.2; 42 5.55,-4.2; 43 5.55,-3.5; 44 5.55,-2.8; 45 5.55,-2.1; 46 5.55,-1.4; 47 5.55,-0.7; 48 5.55,0; 49 5.55,0.7; 50 5.55,1.4; 51 5.55,2.1; 52 5.55,2.8; 53 5.55,3.5; 54 5.55,4.2 | smd 1 x 1: 55 5.65,5.15; 56 -5.65,5.15; 57 -5.65,-5.15; 58 5.65,-5.15; 59 2.4,2.4; 60 0,2.4; 61 -2.4,2.4; 62 2.4,0; 63 0,0; 64 -2.4,0; 65 2.4,-2.4; 66 0,-2.4; 67 -2.4,-2.4 | smd 0.5 x 0.5: 68 4,3.5
SOT95P280X145-5N = smd 1.27 x 0.559: 1 -1.295,0.94; 2 -1.295,0; 3 -1.295,-0.94; 4 1.295,-0.94; 5 1.295,0.94
SOT23-5 = smd 0.55 x 1.2: 1 -0.95,-1.3; 2 0,-1.3; 3 0.95,-1.3; 4 0.95,1.3; 5 -0.95,1.3
QFN-24-NP = smd 0.8 x 0.3: 1 -2,1.25; 2 -2,0.75; 3 -2,0.25; 4 -2,-0.25; 5 -2,-0.75; 6 -2,-1.25; 13 2,-1.25; 14 2,-0.75; 15 2,-0.25; 16 2,0.25; 17 2,0.75; 18 2,1.25 | smd 0.3 x 0.8: 7 -1.25,-2; 8 -0.75,-2; 9 -0.25,-2; 10 0.25,-2; 11 0.75,-2; 12 1.25,-2; 19 1.25,2; 20 0.75,2; 21 0.25,2; 22 -0.25,2; 23 -0.75,2; 24 -1.25,2
HTU21D = smd 0.2 x 0.2: 7 0,0 | smd 0.8 x 0.5: DATA 1.5,-1; GND 1.5,0; NC@1 -1.5,1; NC@6 1.5,1; SCK -1.5,-1; VDD -1.5,0
BGA8DS = smd 0.305 x 0.305: A1 0.5,-0.5; A2 0,-0.5; A3 -0.5,-0.5; B1 0.5,0; B3 -0.5,0; C1 0.5,0.5; C2 0,0.5; C3 -0.5,0.5
BMP180 = smd 0.6 x 0.5: 1 1.5,1.45; 2 0,1.45; 3 -1.5,1.45; 4 -1.5,-1.45; 5 0,-1.45; 6 1.5,-1.45 | smd 0.5 x 0.6: 7 1.5,0
MICRO-SD-SOCKET-PP = smd 0.8 x 1.5: 1 7.54,-11.26; 2 6.44,-10.86; 3 5.34,-11.26; 4 4.24,-11.46; 5 3.14,-11.26; 6 2.04,-11.46; 7 0.94,-11.26; 8 -0.16,-11.26 | smd 1 x 0.95: CD 2.04,-0.175 | smd 1.3 x 1.4: CD1 6.35,-0.4; CD2 0.65,-0.4 | smd 1.4 x 1.9: GND1 12.2,-14.55; GND2 -0.95,-13.55
MIC-9.7MM = drill 0.8 pad 1.676: GND -2,-1.27; SIG -2,1.27
SO08 = smd 0.61 x 2.21: 1 -1.905,-2.616; 2 -0.635,-2.616; 3 0.635,-2.616; 4 1.905,-2.616; 5 1.905,2.616; 6 0.635,2.616; 7 -0.635,2.616; 8 -1.905,2.616

### Placement (x,y rotation side)
ANT1  18,1.5 180 top
BAT  26.03,54.42 270 top
BUZZ  27.3,31 0 top
C1  14.1,22.61 270 top
C2  15.49,22.61 270 top
C3  16.89,22.61 90 top
C4  18.29,22.61 270 top
C5  16.38,6.22 0 top
C6  13.34,6.22 0 top
C7  19,57.43 90 top
C8  23.47,56.59 270 bottom
C9  11.77,1.14 270 top
C10  19,54.71 270 top
C11  27.53,48.39 0 bottom
C12  27.94,50.01 0 bottom
C13  6.02,53.52 90 top
C14  5.41,62.31 0 top
C15  5.59,57.53 180 bottom
C16  11.81,56.94 90 bottom
C17  7.54,53.52 270 top
C18  9.04,53.52 270 top
C19  2.79,52.83 90 bottom
C20  5.59,49.53 0 bottom
C21  5.59,48.01 0 bottom
C22  8.38,3.56 270 top
C23  13.73,33.53 0 bottom
C24  16.27,41.78 180 bottom
C25  15,35.31 0 bottom
C26  13.73,41.78 0 bottom
C27  11.81,54.86 180 bottom
CAM  28.32,14.73 90 top
JP1  15,65 180 top
JP2  1.85,20.07 90 bottom
JTAG  26.04,26.87 0 top
L1  11.77,3.07 270 top
L2  27.76,52.48 180 bottom
LDR  15,52.37 0 bottom
LED  7.24,64.26 270 top
R1  12.4,57.12 90 top
R2  25.07,57 90 bottom
R3  8.71,62.31 0 top
R4  12.7,22.61 90 top
R5  11.3,22.61 90 top
R6  9.91,22.61 270 top
R7  8.51,22.61 90 top
R8  19.3,57.32 270 bottom
R9  4.32,22.61 270 top
R10  5.71,22.61 270 top
R11  7.11,22.61 270 top
R12  15,49.02 0 bottom
R13  6.73,3.56 270 top
R14  13.73,32 0 bottom
R15  16.27,33.53 0 bottom
R16  13.73,43.31 180 bottom
R17  16.27,43.31 180 bottom
R18  15,36.83 0 bottom
R19  21.59,6.22 180 top
RGB_LED  15,48 0 top
S1  7,41 180 top
S2  23,41 180 top
S3  3.68,13.59 90 top
S4  3.68,5.46 270 top
SW  24.43,60 0 top
TP1  24.51,16.64 0 bottom
TP2  24.51,14.73 0 bottom
TP3  24.51,12.83 0 bottom
TP4  24.51,10.92 0 bottom
U1  15,13.59 90 top
U2  15.38,56.67 90 top
U3  27.51,56.21 0 bottom
U4  5.78,58 0 top
U5  7,61 90 bottom
U6  15,57.74 0 bottom
U7  7,53 270 bottom
U8  20.6,19.13 0 bottom
U9  15,31.4 90 top
U10  15,39.24 270 bottom
U11  3.3,7.62 0 bottom

### Tracks (layer width: path | path; a pad name or v marks a point on that pad's centre or on a via)
!MODE  (via drill 0.3)
  Top 0.254: U1.53 11.5,20.12 v11.18,20.45 | v4.06,13.59 3.68,13.97 S3.2
  Bottom 0.254: v11.18,20.45 10.03,19.3 10.03,14.99 8.64,13.59 v4.06,13.59
!RST  (via drill 0.3, 0.3 pad 0.3)
  Top 0.254: U1.26 18.5,9.91 v18.54,9.91 v18.54,17.4 | S4.2 3.97,3.05 R13.2 C22.2 v8.38,1.78
  $+3V3 0.254: JTAG.6 28.37,24.33 28.7,24 28.7,21.21 26.54,19.05 24.13,19.05 22.86,17.78 18.92,17.78 v18.54,17.4 | v18.54,9.91 17.27,8.64 9.4,8.64 8.64,7.87 8.64,2.03 v8.38,1.78
+3V3  (via drill 0.3)
  Top 0.254: U1.46 U1.47 16.34,19.14 16.38,19.18 16.38,20.07 16.76,20.45 v16.76,20.95 16.76,21.97 C3.1 C4.2 | RGB_LED.A 15.95,49.4 v18.16,49.4 | R13.1 6.6,4.19 v6.6,7.49 | C5.1 v14.86,6.22 C6.2 13.84,6.86 13.6,7.1 U1.19 U1.20 | 15.37,22.1 C2.2 C1.2 v14.1,20.95 14.1,20.19 14.3,19.99 U1.49 | R6.1 9.91,23.75 9.45,24.21 v9.22,24.21 9.09,24.21 8.51,23.62 R7.2 | U4.13 7.78,55.98 8,55.75 9.14,55.75 10.67,54.23 10.67,53.01 | 10.67,53.01 C18.2 C17.2 7.54,52.12 7.11,51.69 5.46,51.69 5.03,52.12 5.03,54.74 | 10.67,53.01 13.09,53.01 LDR.2 | U4.8 5.03,54.74 | U4.3 3,58.25 2.67,57.91 2.67,55.37 3.3,54.74 5.03,54.74
  $+3V3 0.254: v14.86,6.22 14.86,7.24
  Bottom 0.203: U6.B1 12.78,57.74 12.57,57.53 11.89,57.53 C16.2
  Bottom 0.254: 2.92,54.23 C19.+ 2.67,54.23 | U7.2 U7.3 3.19,54.5 2.92,54.23 | v3.68,49.53 C20.2 C21.2 | U5.VDD 6.99,59.48 6.99,57.91 6.6,57.53 C15.2 5.97,57.4 5.97,56.64 5.59,56.26 v1.65,56.26 1.02,56.26 0.89,56.13 0.89,54.48 1.14,54.23 2.92,54.23 | C16.2 11.73,57.53 v10.54,57.53 | U6.A3 15.5,55.38 13.84,53.72 | 28.57,57.4 29.08,57.4 29.46,57.02 29.46,54.61 29.08,54.23 29.08,52.7 L2.2 | R16.1 13.21,43.32 v13.21,44.83 | U8.4 16.38,7.65 16.38,6.6 16,6.22 v14.86,6.22 | R14.1 v15.75,32 | R8.2 20.11,56.56 20.57,57.02 v20.57,57.4 | U11.7 U11.8 5.21,7.62 | U11.3 2.67,7.62 5.21,7.62 | 5.21,7.62 6.48,7.62 v6.6,7.49
  Bottom 0.305: R16.1 C26.2 13.22,41.13 13.59,40.77 13.59,40.3 U10.5 | C27.2 12.32,53.98 12.83,53.47 13.84,53.47 | 13.84,53.72 13.84,53.47 | 13.84,53.47 13.84,52.48 LDR.2
  Bottom 0.406: U3.5 28.57,57.51 28.57,57.4
  other vias: 28.02,47.19 28.73,47.19 28.37,46.56
  pour Bottom (no thermals): 28.3,53.9 28.42,54.05 29.24,54.05 29.46,53.85 29.46,51.03 29.13,50.7 29.13,46.43 28.8,46.1 27.97,46.1 27.64,46.38 27.64,49.25 28.09,49.71 28.09,50.88 28.24,51.05 28.24,53.85
  pour $+3V3 (isolate 0.203, rank 2): 0.5,65 29.5,65 29.5,7 0.5,7
ANT
  Top 0.33: L1.1 11.77,5.24 arc45 11.59,5.68 10.99,6.29 arc-45 10.8,6.74 U1.15
BUZZ+/TDO
  Top 0.254: JTAG.7 26.04,20.57 23.6,18.14 U1.41
  Bottom 0.254: BUZZ.+ 26.04,29.59 24.64,28.19 24.64,23.62 25.15,23.11 25.98,23.11 JTAG.7
BUZZ-/TCK
  Top 0.254: JTAG.8 27.3,20.45 24.3,17.44 U1.40
  Bottom 0.254: BUZZ.- 28.57,23.5 28.19,23.11 27.36,23.11 JTAG.8
D2  (via drill 0.3, 0.3 pad 0.71)
  Top 0.305: 8.79,16.74 v8.76,16.64 8.87,16.74 U1.3
  $GND 0.254: v8.76,16.64 7.62,16.64 4.32,19.94 4.32,23.88 3.05,25.15 JP2.3
  $+3V3 0.254: v7.62,6.35 7.62,15.49 v8.76,16.64
  Bottom 0.254: U11.1 5.21,5.71 5.46,5.97 7.11,5.97 7.49,6.35 v7.62,6.35
ENABLE  (via drill 0.3)
  Top 0.254: v28.83,56.21 28.83,55.63 25.4,52.2 v24.89,52.2
  Bottom 0.254: U3.1 28.45,54.92 28.45,55.63 28.83,56.01 v28.83,56.21 | v24.89,52.2 25.07,52.38 R2.1
GND  (via drill 0.3)
  Bottom 0.203: U6.C1 12.76,58.24 12.7,58.29 | 14.48,55.5 14.5,55.5 U6.A1 U6.A2
  Bottom 0.254: U7.7 7,50.29 6.87,50.16 6.22,50.16 6.1,50.04 C20.1 | 6.99,63.75 6.99,62.52 U5.GND U5.7
  other vias: 27.03,56.21 27.84,56.21 13.08,61.9 16.23,14.68 13.69,14.68 13.69,12.27 16.23,12.27 22.71,19.25 12.6,0.66 10.95,0.66 12.65,2.59 12.65,3.73 12.78,4.75 14.17,4.85 15.7,4.85 17.22,4.85 18.75,4.85 20.27,4.85 23.32,4.85 24.84,4.85 26.37,4.85 27.89,4.85 29.16,4.85 29.16,6.12 29.16,7.65 29.16,9.17 9.55,0.66 8.15,0.66 6.76,0.66 3.96,0.66 5.36,0.66 2.57,0.66 1.17,0.66 11.63,6.78 9.98,6.78 10.24,5.89 10.87,5.13 10.87,4.11 10.87,2.08
  pour $GND: 0,65 30,65 30,4.5 13,4.5 13,0 0,0
  pour Top (isolate 0.203, rank 3): 0.5,65 29.5,65 29.5,4.58 12.92,4.58 12.92,0 0.5,0
  pour Bottom (rank 2): 0,65 30,65 30,4.5 13,4.5 13,0 0,0
LDR  (via drill 0.3)  (1 unrouted)
  Top 0.254: 9.42,18.14 9.29,18.14 9.14,18.29 9.02,18.29 8.89,18.41 8.89,18.67 v8.64,18.92
  Bottom 0.254: v8.64,18.92 8.64,20.32 11.68,23.37 18.29,23.37 20.57,25.65 20.57,51.05 19.26,52.37 LDR.1
  Bottom 0.305: LDR.1 16.27,51.07 15.88,50.67 15.88,49.13 R12.1
MCU_USB_DM
  Top 0.254: U1.52 12.19,20.45 11.3,21.34 R5.1
MCU_USB_DP
  Top 0.254: U1.51 12.9,20.63 12.7,20.83 R4.1
MIC  (via drill 0.3)
  Top 0.254: U1.2 8.98,17.44 v8.76,17.65
  Bottom 0.254: v8.76,17.65 8.13,17.65 7.37,18.29 7.37,20.7 11.3,24.64 18.16,24.64 19.68,26.16 19.68,33.91 18.29,35.31 C25.1
  Bottom 0.305: C25.1 R18.1 17.65,36.83 18.16,37.34 18.16,39.88 17.85,40.19 U10.1
MISO  (via drill 0.3, 0.3 pad 0.71)
  Top 0.254: U1.25 17.8,6.2 18.03,5.97 18.41,5.97 v18.54,6.1
  $GND 0.254: v18.54,6.1 16.89,6.1 15.24,7.87 8,7.87 6.86,6.73 v5.33,6.73
  Bottom 0.254: TP4.P$1 21.59,10.92 19.68,9.02 19.68,7.89 U8.7 | U11.2 3.94,6.73 v5.33,6.73
  Bottom 0.305: v18.54,6.1 19.18,6.1 19.43,6.35 19.43,7.64 U8.7
MOSI  (via drill 0.3)
  Top 0.254: U1.23 16.4,9.38 v15.88,9.91
  $GND 0.254: v1.4,8.26 1.52,8.13 4.95,8.13 6.12,9.29 13.44,9.29 14.1,8.64 14.99,8.64 15.24,8.89 15.24,9.27 v15.88,9.91
  Bottom 0.254: U8.3 15.26,9.29 v15.88,9.91 16.51,10.54 16.89,10.54 17.78,11.43 19.43,11.43 21.46,13.46 21.97,13.46 23.24,14.73 TP2.P$1 | v1.4,8.26 U11.5
N$1
  Top 0.33: L1.2 C9.1 14.37,1.63 ANT1.1
N$2
  pour Bottom (isolate 0.254, no thermals): 23.37,59.44 23.37,60.45 23.88,60.96 24.89,60.96 25.4,60.45 25.4,59.44 26.42,58.42 26.92,58.42 27.18,58.17 27.18,57.15 26.92,56.9 26.16,56.9 25.91,57.15 22.86,57.15 22.61,57.4 22.61,58.67
N$3
  Bottom 0.406: L2.1 26.56,52.58 U3.3
  pour Bottom (no thermals): 26.26,54.33 26.16,54.23 26.16,51.1 26.24,51.03 27.1,51.03 27.18,51.1 27.18,53.85 27.18,54 26.85,54.33
N$4
  Top 0.305: U2.5 14.37,57.89 R1.2
N$5
  Top 0.254: R3.1 8,62.36 8,62.99 8.45,63.44 8.45,64.25 LED.C@1
N$6
  Top 0.305: U2.1 14.31,55.24 10.92,55.24 9.47,56.69 R3.2
N$7
  Bottom 0.305: C23.1 R15.2
N$8
  Bottom 0.305: U10.4 13.7,36.97 13.84,36.83 R18.2 C25.2 14.48,35.29 14.48,34.67 14.73,34.42 16.51,34.42 16.78,34.15 R15.1
N$9
  Bottom 0.305: R16.2 R17.1 C24.1 15.76,41.16 15.11,40.51 15.11,38.61 15.37,38.35 16.24,38.35 U10.3
N$10
  Bottom 0.254: R14.2 13.22,30.97 13.73,30.47 U9.SIG
  Bottom 0.305: R14.2 C23.2
N$12
  Top 0.254: C14.2 5.92,61.77 6.53,61.16 U4.20
N$13
  Bottom 0.203: U6.C2 14.99,58.25 14.99,60.33 15.49,60.83 16.26,60.83 16.76,61.34 18.92,61.34 19.3,60.96 R8.1
N$14
  Top 0.254: U4.10 C13.2
N$15
  cutout $GND: 13.05,61.96 13.06,61.96 arc-91
N$16
  cutout $GND: 16.95,61.96 16.96,61.96 arc-91
N$17  (via drill 0.3)
  Top 0.254: v11.3,25.78 R5.2 | JP1.2 15.65,61.62 v15.93,61.9
  $+3V3 0.254: v15.93,61.9 15.93,59.61 10.67,54.36 v10.67,47.37
  Bottom 0.254: v10.67,47.37 10.67,26.42 v11.3,25.78
N$18  (via drill 0.3)
  Top 0.254: v12.7,25.78 R4.2 | JP1.3 15,61.58 v14.68,61.9
  $+3V3 0.254: v14.68,61.9 14.68,59.89 9.53,54.74 v9.53,47.37
  Bottom 0.254: v12.7,25.78 11.56,26.92 11.56,48.13 11.18,48.51 9.91,48.51 9.53,48.13 v9.53,47.37
N$20
  cutout Bottom: 13.05,61.96 13.06,61.96 arc-91
N$21
  cutout Bottom: 16.95,61.96 16.96,61.96 arc-91
N$23
  cutout Bottom (no thermals): 13,59.74 13,55.74 17,55.74 17,59.74
  cutout Bottom (no thermals): 4.5,63.5 4.5,58.5 9.5,58.5 9.5,63.5
  cutout Bottom (no thermals): 4.5,55.5 4.5,50.5 9.5,50.5 9.5,55.5
N$27
  Top 0.254: RGB_LED.G 12.26,46.55 11.3,45.59 11.3,42.29 10.29,41.27 7.62,41.27 6.73,40.39 6.73,26.67 5.71,25.65 R10.1
N$29
  Top 0.254: RGB_LED.B 15.75,46.4 15.75,40.89 14.48,39.62 8.38,39.62 7.75,38.99 7.75,26.16 7.11,25.53 R11.1
N$54
  Top 0.254: RGB_LED.R 14.05,49.4 8.51,49.4 6.73,47.62 6.73,43.31 3.3,39.88 3.3,34.29 4.32,33.27 R9.1
PBL/TDI  (via drill 0.3)
  Top 0.254: U1.43 18.5,20.02 19.3,20.83 22.35,20.83 23.37,21.84 23.37,24.13 24.89,25.65 25.98,25.65 JTAG.3 | 8.76,35.96 S1.3 9.25,27.45 9.65,27.05 20.32,27.05 v21.46,25.91
  $+3V3 0.254: JTAG.3 22.66,25.6 22.35,25.91 v21.46,25.91
PBR/TMS
  Top 0.254: U1.44 17.8,20.09 19.05,21.34 22.1,21.34 22.86,22.1 22.86,24.38 22.86,24.89 | 22.86,24.89 24.89,26.92 25.98,26.92 JTAG.1 | S2.3 25.12,36.32 23.62,36.32 22.86,35.56 22.86,24.89
RGB_BLUE
  Top 0.254: U1.6 9.92,14.61 7.24,14.61 6.73,15.11 6.73,20.32 7.11,20.7 R11.2
RGB_GREEN
  Top 0.254: U1.7 9.92,13.97 6.73,13.97 6.1,14.61 6.1,18.41 5.71,18.8 R10.2
RGB_RED
  Top 0.254: U1.8 9.92,13.21 6.48,13.21 5.46,14.22 5.46,18.03 4.32,19.18 R9.2
RX
  Top 0.254: U1.38 25.49,16.04 26.42,15.11 26.42,13.84 26.8,13.46 CAM.RX
SCK  (via drill 0.3)
  Top 0.254: U1.24 17.1,9.73 v17.27,9.91
  $GND 0.254: v2.67,12.83 3.3,12.19 5.46,12.19 6.6,11.05 16.64,11.05 17.27,10.41 v17.27,9.91
  Bottom 0.254: v17.27,9.91 17.46,9.72 | 17.46,9.72 U8.5 | 17.46,9.72 17.46,10.09 18.16,10.79 19.81,10.79 21.84,12.83 TP3.P$1 | v2.67,12.83 U11.6
SCL  (via drill 0.3)
  Top 0.203: U4.23 5.03,61.14 4.7,61.47 3.05,61.47 v2.67,61.85
  Top 0.254: R7.1 8.51,21.34 7.37,20.19 7.37,15.75 7.87,15.24 9.14,15.24 9.24,15.34 U1.5 11.08,15.34 v11.3,15.11
  $+3V3 0.254: v2.67,61.85 8.51,56.01 v8.51,48.39 | v8.51,30.73 9.91,30.73 14.1,26.54 14.1,24 12.95,22.86 12.95,15.75 12.32,15.11 v11.3,15.11 11.08,15.34 U1.5 9.91,15.38 9.91,18.92 8.76,20.07 4.19,20.07 | v9.65,43.05 10.03,43.05 14.99,48.01 14.99,54.36 18.41,57.78 v18.41,59.44
  $+3V3 0.305: JP2.1 4.19,20.07
  Bottom 0.203: U6.B3 17.86,57.74 18.16,58.04 18.16,59.05 18.41,59.31 v18.41,59.44
  Bottom 0.254: U7.5 8.49,52.96 10.03,52.96 10.41,52.58 10.41,49.66 10.16,49.4 8.76,49.4 8.51,49.15 v8.51,48.39 8.51,42.93 | U5.SCK 1.84,59.5 1.4,59.94 1.4,61.47 1.78,61.85 v2.67,61.85 | 8.51,42.93 v8.51,30.73 | v9.65,43.05 9.53,42.93 8.51,42.93
SD_CD/TRST  (via drill 0.3)
  Top 0.254: U1.42 19.2,19.96 19.56,20.32 22.61,20.32 23.37,21.08 | 23.37,21.08 23.88,21.59 23.88,23.37 24.89,24.38 25.98,24.38 JTAG.5 | v24,20.45 23.37,21.08
  Bottom 0.254: U8.CD 18.56,20.34 19.43,21.21 23.24,21.21 v24,20.45
SD_CS  (via drill 0.3)
  Top 0.254: U1.22 15.7,8.94 14.73,9.91 v14.48,9.91
  Bottom 0.254: U8.2 14.16,9.46 14.48,9.78 v14.48,9.91 15.62,11.05 16.38,11.05 17.4,12.06 19.18,12.06 23.75,16.64 TP1.P$1
SDA  (via drill 0.3)
  Top 0.203: U4.24 4.53,60.75 4.32,60.96 3.05,60.96 v2.67,60.58
  Top 0.254: R6.2 9.91,20.83 9.53,20.45 8.64,20.45 8,19.81 8,16.26 8.35,15.91 9.05,15.91 9.18,16.04 U1.4 10.96,16.04 v11.3,16.38
  $+3V3 0.254: v8.51,26.8 7.87,26.8 7.62,26.54 7.62,22.61 7.62,22.1 10.16,19.56 10.67,19.56 11.3,18.92 v11.3,16.38 | v7.62,49.66 7.62,46.23 8.26,45.59 10.54,45.59 11.81,46.86 11.81,53.21 v17.4,58.8
  $+3V3 0.305: JP2.2 7.62,22.61 | 2.79,60.58 v2.67,60.58 5.84,57.4 5.84,54.74 7.62,52.96 v7.62,49.66
  Bottom 0.203: U6.C3 17.2,58.24 17.4,58.44 v17.4,58.8 | U5.DATA 5.98,62.48
  Bottom 0.254: 8.52,51.44 U7.6 8.45,50.11 8.13,49.78 7.75,49.78 v7.62,49.66 7.62,28.57 8.51,27.69 v8.51,26.8 | 5.98,62.48 3.94,62.48 3.68,62.23 3.68,60.96 3.3,60.58 v2.67,60.58
TX
  Top 0.254: U1.39 26.06,16.74 26.8,16 CAM.TX
UVCC  (via drill 0.3)
  Top 0.254: v10.79,64.14 10.79,60.07 11.81,59.05 16.3,59.05 | v4.19,64.26 LED.A@1
  Top 0.406: C7.2 19,57.96 U2.4 16.3,57.96 16.3,59.05 JP1.1
  Bottom 0.254: v10.79,64.14 10.67,64.26 v4.19,64.26
VBAT  (via drill 0.6)
  Top 0.406: BAT.+ 21.84,53.42 19.22,53.42 19,53.65 C10.2 | 18.92,54.13 C10.2 | C10.2 16.79,54.2 16.32,54.67 U2.3
  Top 1.016: 21.84,53.42 22.61,53.42 v22.61,51.56
  Bottom 1.016: v22.61,51.56 21.89,52.28 SW.2
WKP  (via drill 0.3 pad 0.71)
  Top 0.254: U1.27 19.2,7.09 19.3,6.99 19.68,6.99 20.07,6.6 | R19.2 20.19,6.22 v20.07,6.1
  Top 0.305: U4.12 7.03,55.08 v7.11,54.99 | v20.07,6.1 20.07,6.6
  $GND 0.305: v7.11,54.99 7.11,54.48 16.26,45.34 16.26,35.43 19.56,32.13 19.56,20.19 20.7,19.05 20.7,6.73 v20.07,6.1

### Text on the board
tPlace: + | SENSg | Gyro | Accel | 12 MAY 15 | Y | X | Z | Mag | X | Y | Z | MODE | RESET
bNames: CRX | CTX/SDA | SCL | CS | SI | CK | SO
tDocu: NOTES: / / Layer stack up: / 1 - GTL - Top Copper / 2 - G2L - Inner Ground / 15 - G15L - Inner +3.3V / 16 - GBL - Bottom Copper | REV: | CHANGELOG: / -V3.2 Changed Battery "+" / Route / --Changed USB / --Removed Short / --Updated MIC / -V3.3 Corrected for DFM / Errors